# Altium schematic sheet button_peripheral.SchDoc
size A4
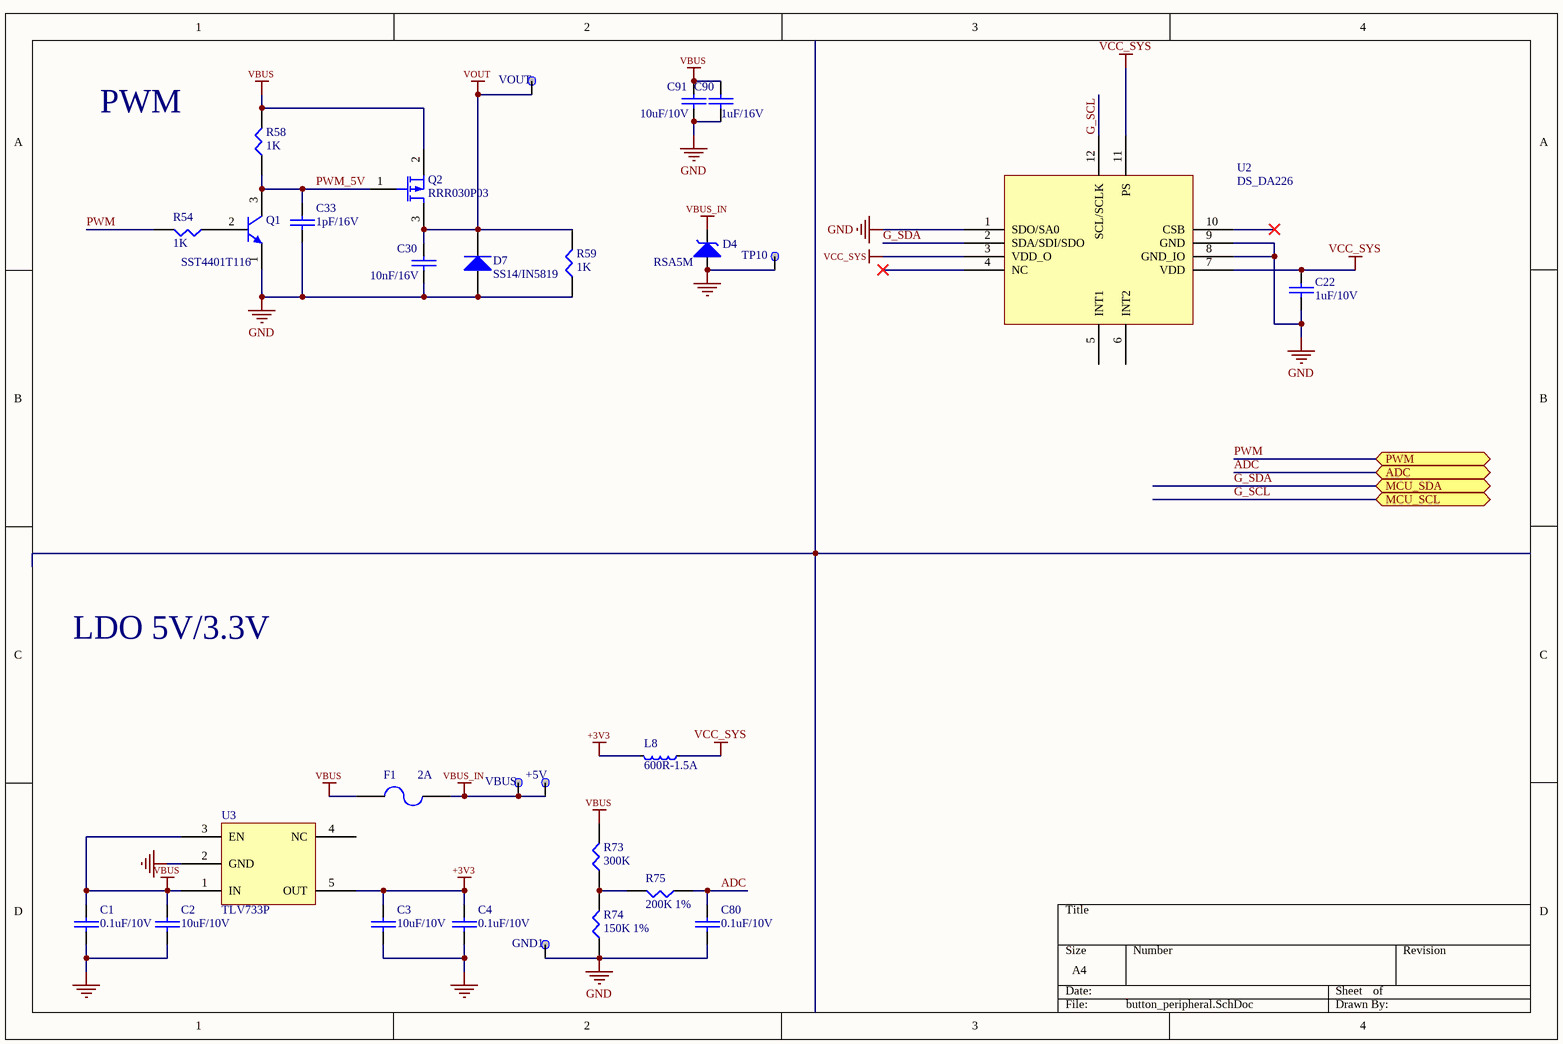
[diagram p0: button_peripheral.SchDoc]

## Parts
+5V  TP  [TESTPOINT2]  (value not drawn)
C1  0.1uF/10V  [0402C]
C2  10uF/10V  [0603C]
C3  10uF/10V  [0603C]
C4  0.1uF/10V  [0402C]
C22  1uF/10V  [0402C]
C30  10nF/16V  [0402C]
C33  1pF/16V  [0402C]
C80  0.1uF/10V  [0402C]
C90  1uF/16V  [0603C]
C91  10uF/10V  [LC-CASE-P_2012]
D4  RSA5M  [SOD-123]
D7  SS14/IN5819  [PROGRAM_1/2]
F1  2A  [0805]
GND1  TP  [TESTPOINT_PAD]  (value not drawn)
L8  600R-1.5A  [L_0603]
Q1  SST4401T116  [LC-SOT-23(SOT-23-3)]
Q2  RRR030P03  [TSMT3]
R54  1K  [0402R]
R58  1K  [0402R]
R59  1K  [0402R]
R73  300K  [0402R]
R74  150K 1%  [0402R]
R75  200K 1%  [0402R]
TP10  TP  [TESTPOINT_PAD]  (value not drawn)
U2  DS_DA226  [LGA-12]
U3  TLV733P  [SOT-23-5]
VBUS  TP  [TESTPOINT_PAD]  (value not drawn)
VOUT  TP  [TESTPOINT_PAD]  (value not drawn)

## Ports
ADC, MCU_SCL, MCU_SDA, PWM

## Nets
+3V3: C3.1 C4.1 L8.2 U3.5(OUT)
GND: C1.2 C2.2 C3.2 C4.2 C22.2 C30.2 C33.2 C80.2 C90.2 C91.2 D4.2(dIode2) D7.2(A) GND1.1 Q1.1(E) R59.1 R74.1 TP10.1 U2.1(SDO/SA0) U2.8(GND_IO) U2.9(GND) U3.2(GND)
VBUS: C1.1 C2.1 C90.1 C91.1 F1.1 Q2.2(S) R58.2 R73.2 U3.1(IN) U3.3(EN)
VBUS_IN: +5V.1 D4.1(Diode1) F1.2 VBUS.1
VCC_SYS: C22.1 L8.1 U2.3(VDD_O) U2.7(VDD) U2.11(PS)
VOUT: C30.1 D7.1(K) Q2.3(D) R59.2 VOUT.1
ADC: C80.1 R75.1 ; port ADC
G_SCL: U2.12(SCL/SCLK) ; port MCU_SCL
G_SDA: U2.2(SDA/SDI/SDO) ; port MCU_SDA
PWM: R54.2 ; port PWM
PWM_5V: C33.1 Q1.3(C) Q2.1(G) R58.1
NetQ1_2: Q1.2(B) R54.1
NetR73_1: R73.1 R74.2 R75.2

Not connected (* = marked no-connect by the designer): U2 4(NC)* 5(INT1) 6(INT2) 10(CSB)*; U3 4(NC)

## Notes on the sheet
- PWM
- LDO 5V/3.3V

## Library data of the parts
+5V GND1 TP10 VBUS VOUT = TP: Ordered by: Subcon
C1 C4 C22 C30 C33 C80 = CAP: 厂家：Murata，型号：GRM155R71A104KA01D
C2 C3 C90 C91 = CAP: 厂家：Murata，型号：GRM188R61A106KE69D
D4 = ESD_1: 厂家：ROHM，型号：VMNZC6.8CST2RA
D7 = Diode 1N4148: High Conductance Fast Diode
F1 = FUSE2: 厂家：万瑞和，型号：smd1206-200
L8 = L0402-27n: High frequency chip inductor ±5%; Manufacturer: Murata; Manufacturer Part Number: LQP15MN27NG02D; Value: 27nH; Note: High frequency chip inductor ±2%; Artikkelnr Noca: N.A.; Part Number: L0402-27n; Datasheet: http://search.murata.co.jp/Ceramy/image/img/PDF/ENG/L0075S0084LQP15M.pdf; LatestRevisionDate: 2014-09-17; Pin Count: 2; Publisher: Nordic Semiconductor; Published: 2014-06-12; Supplier: Digi-Key; Supplier part number: 490-6751-1-ND; 2nd source Supplier: *; 2nd source part number: *; Footprint Doc: 0402; Artikkelnr Simpro: N.A.
Q1 = 2N3904: NPN General Purpose Amplifier; Published: 8-Jun-2000; LatestRevisionDate: 15-Jan-2003; LatestRevisionNote: PCB Footprint 'BCY-W3/D4.7' replaced; DatasheetVersion: 1997; PackageVersion: Sep-1998; PackageReference: TO-92A; Publisher: Altium Limited; PackageDescription: TO, Flat Index; 3 In-Line, Axial Leads; Body Dia. 4.5mm; Leads 0.51 x 0.48 mm (max); ComponentLink1Description: Manufacturer Link; ComponentLink1URL: http://www.fairchildsemi.com/; ComponentLink2Description: Datasheet; ComponentLink2URL: http://www.fairchildsemi.com/ds/2N%2F2N3904.pdf
Q2 = MOSFET-P: P-Channel MOSFET; Published: 8-Jun-2000; LatestRevisionDate: 17-Jul-2002; LatestRevisionNote: Re-released for DXP Platform.; PackageVersion: 1995/1996; PackageReference: E3; Publisher: Altium Limited; PackageDescription: TO, Flat Index; 3 In-Line, Axial Leads; Body Dia. 4.6mm; Lead Dia. 0.5 mm (max)
R54 R58 R59 R73-R75 = RES1: 厂家：Yageo，型号：RC0402FR-0720RL
U2 = LI: 厂家：ST，型号：LIS2DH12
U3 = AP3410